# Altium project MCH_CLKB.PrjPcb (part 3 of 3)

## Sheet CLKB_uplinks.SchDoc
size A3
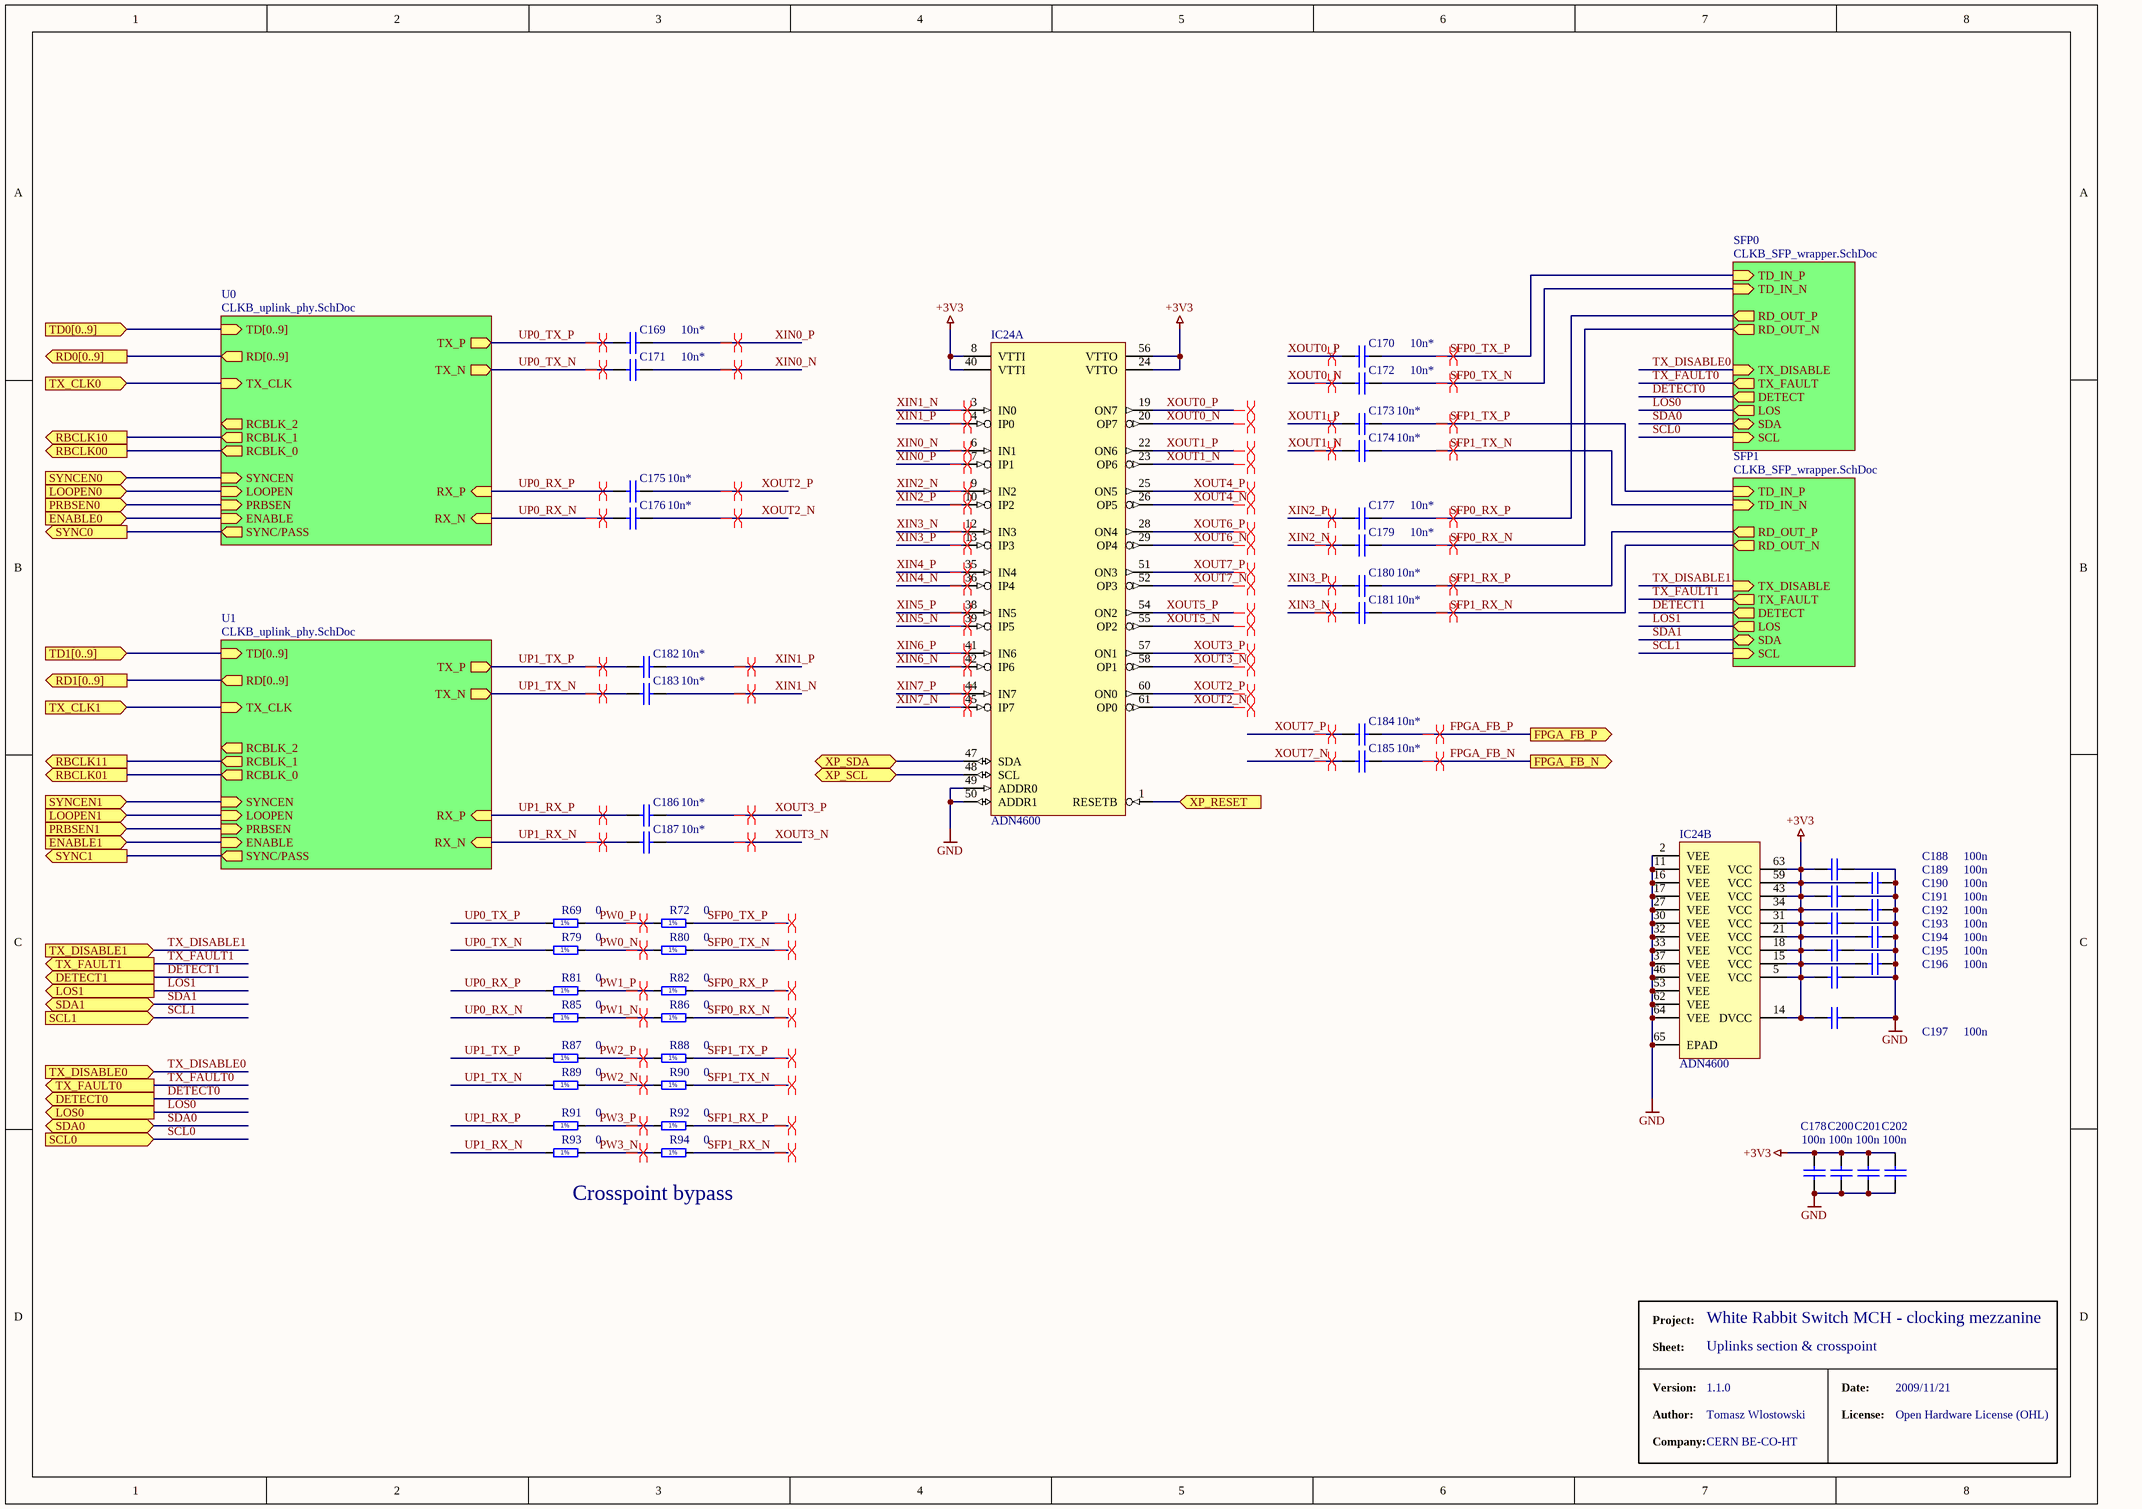
[diagram p4: CLKB_uplinks.SchDoc]

### Parts
C169  10n*  [CAPC1005X55N]
C170  10n*  [CAPC1005X55N]
C171  10n*  [CAPC1005X55N]
C172  10n*  [CAPC1005X55N]
C173  10n*  [CAPC1005X55N]
C174  10n*  [CAPC1005X55N]
C175  10n*  [CAPC1005X55N]
C176  10n*  [CAPC1005X55N]
C177  10n*  [CAPC1005X55N]
C178  100n  [CAPC1005X55N]
C179  10n*  [CAPC1005X55N]
C180  10n*  [CAPC1005X55N]
C181  10n*  [CAPC1005X55N]
C182  10n*  [CAPC1005X55N]
C183  10n*  [CAPC1005X55N]
C184  10n*  [CAPC1005X55N]
C185  10n*  [CAPC1005X55N]
C186  10n*  [CAPC1005X55N]
C187  10n*  [CAPC1005X55N]
C188  100n  [CAPC1005X55N]
C189  100n  [CAPC1005X55N]
C190  100n  [CAPC1005X55N]
C191  100n  [CAPC1005X55N]
C192  100n  [CAPC1005X55N]
C193  100n  [CAPC1005X55N]
C194  100n  [CAPC1005X55N]
C195  100n  [CAPC1005X55N]
C196  100n  [CAPC1005X55N]
C197  100n  [CAPC1005X55N]
C200  100n  [CAPC1005X55N]
C201  100n  [CAPC1005X55N]
C202  100n  [CAPC1005X55N]
IC24  ADN4600  [LFCSP64_ADN4600]  (parts A,B of 2)
R69  0  [RESC1005X40N]
R72  0  [RESC1005X40N]
R79  0  [RESC1005X40N]
R80  0  [RESC1005X40N]
R81  0  [RESC1005X40N]
R82  0  [RESC1005X40N]
R85  0  [RESC1005X40N]
R86  0  [RESC1005X40N]
R87  0  [RESC1005X40N]
R88  0  [RESC1005X40N]
R89  0  [RESC1005X40N]
R90  0  [RESC1005X40N]
R91  0  [RESC1005X40N]
R92  0  [RESC1005X40N]
R93  0  [RESC1005X40N]
R94  0  [RESC1005X40N]

### Sub-sheets
SFP0 = CLKB_SFP_wrapper.SchDoc: TX_FAULT (out), TX_DISABLE (in), SDA (bidir), SCL (in), DETECT (out), LOS (out), RD_OUT_N (out), RD_OUT_P (out), TD_IN_N (in), TD_IN_P (in)
SFP1 = CLKB_SFP_wrapper.SchDoc: TX_FAULT (out), TX_DISABLE (in), SDA (bidir), SCL (in), DETECT (out), LOS (out), RD_OUT_N (out), RD_OUT_P (out), TD_IN_N (in), TD_IN_P (in)
U0 = CLKB_uplink_phy.SchDoc: TD[0..9] (in), SYNCEN (in), LOOPEN (in), PRBSEN (in), ENABLE (in), SYNC/PASS (out), RD[0..9] (out), TX_CLK (in), TX_N (out), TX_P (out), RX_P (in), RX_N (in), RCBLK_0 (out), RCBLK_1 (out), RCBLK_2 (out)
U1 = CLKB_uplink_phy.SchDoc: TD[0..9] (in), SYNCEN (in), LOOPEN (in), PRBSEN (in), ENABLE (in), SYNC/PASS (out), RD[0..9] (out), TX_CLK (in), TX_N (out), TX_P (out), RX_P (in), RX_N (in), RCBLK_0 (out), RCBLK_1 (out), RCBLK_2 (out)

### Ports
DETECT0 (out), DETECT1 (out), ENABLE0 (in), ENABLE1 (in), FPGA_FB_N (out), FPGA_FB_P (out), LOOPEN0 (in), LOOPEN1 (in), LOS0 (out), LOS1 (out), PRBSEN0 (in), PRBSEN1 (in), RBCLK00 (out), RBCLK01 (out), RBCLK10 (out), RBCLK11 (out), RD0[0..9] (out), RD1[0..9] (out), SCL0 (in), SCL1 (in), SDA0 (bidir), SDA1 (bidir), SYNC0 (out), SYNC1 (out), SYNCEN0 (in), SYNCEN1 (in), TD0[0..9] (in), TD1[0..9] (in), TX_CLK0 (in), TX_CLK1 (in), TX_DISABLE0 (in), TX_DISABLE1 (in), TX_FAULT0 (out), TX_FAULT1 (out), XP_RESET (in), XP_SCL (bidir), XP_SDA (bidir)

### Nets
+3V3: C178.2 C188.1 C189.1 C190.1 C191.1 C192.1 C193.1 C194.1 C195.1 C196.1 C197.1 C200.2 C201.2 C202.2 IC24.5(VCC) IC24.8(VTTI) IC24.14(DVCC) IC24.15(VCC) IC24.18(VCC) IC24.21(VCC) IC24.24(VTTO) IC24.31(VCC) IC24.34(VCC) IC24.40(VTTI) IC24.43(VCC) IC24.56(VTTO) IC24.59(VCC) IC24.63(VCC)
GND: C178.1 C188.2 C189.2 C190.2 C191.2 C192.2 C193.2 C194.2 C195.2 C196.2 C197.2 C200.1 C201.1 C202.1 IC24.2(VEE) IC24.11(VEE) IC24.16(VEE) IC24.17(VEE) IC24.27(VEE) IC24.30(VEE) IC24.32(VEE) IC24.33(VEE) IC24.37(VEE) IC24.46(VEE) IC24.49(ADDR0) IC24.50(ADDR1) IC24.53(VEE) IC24.62(VEE) IC24.64(VEE) IC24.65(EPAD)
CY0_U0: port RBCLK00, sheet U0/RCBLK_0
CY0_U1: port RBCLK01, sheet U1/RCBLK_0
CY1_U0: port RBCLK10, sheet U0/RCBLK_1
CY1_U1: port RBCLK11, sheet U1/RCBLK_1
DETECT0: port DETECT0, sheet SFP0/DETECT
DETECT1: port DETECT1, sheet SFP1/DETECT
ENABLE0: port ENABLE0, sheet U0/ENABLE
ENABLE1: port ENABLE1, sheet U1/ENABLE
FPGA_FB_N: C185.2 ; port FPGA_FB_N
FPGA_FB_P: C184.2 ; port FPGA_FB_P
LOOPEN0: port LOOPEN0, sheet U0/LOOPEN
LOOPEN1: port LOOPEN1, sheet U1/LOOPEN
LOS0: port LOS0, sheet SFP0/LOS
LOS1: port LOS1, sheet SFP1/LOS
PRBSEN0: port PRBSEN0, sheet U0/PRBSEN
PRBSEN1: port PRBSEN1, sheet U1/PRBSEN
PW0_N: R79.2 R80.1
PW0_P: R69.2 R72.1
PW1_N: R85.2 R86.1
PW1_P: R81.2 R82.1
PW2_N: R89.2 R90.1
PW2_P: R87.2 R88.1
PW3_N: R93.2 R94.1
PW3_P: R91.2 R92.1
SCL0: port SCL0, sheet SFP0/SCL
SCL1: port SCL1, sheet SFP1/SCL
SDA0: port SDA0, sheet SFP0/SDA
SDA1: port SDA1, sheet SFP1/SDA
SFP0_RX_N: C179.2 R86.2 ; sheet SFP0/RD_OUT_N
SFP0_RX_P: C177.2 R82.2 ; sheet SFP0/RD_OUT_P
SFP0_TX_N: C172.2 R80.2 ; sheet SFP0/TD_IN_N
SFP0_TX_P: C170.2 R72.2 ; sheet SFP0/TD_IN_P
SFP1_RX_N: C181.2 R94.2 ; sheet SFP1/RD_OUT_N
SFP1_RX_P: C180.2 R92.2 ; sheet SFP1/RD_OUT_P
SFP1_TX_N: C174.2 R90.2 ; sheet SFP1/TD_IN_N
SFP1_TX_P: C173.2 R88.2 ; sheet SFP1/TD_IN_P
SYNC0: port SYNC0, sheet U0/SYNC/PASS
SYNC1: port SYNC1, sheet U1/SYNC/PASS
SYNCEN0: port SYNCEN0, sheet U0/SYNCEN
SYNCEN1: port SYNCEN1, sheet U1/SYNCEN
TX_CLK0: port TX_CLK0, sheet U0/TX_CLK
TX_CLK1: port TX_CLK1, sheet U1/TX_CLK
TX_DISABLE0: port TX_DISABLE0, sheet SFP0/TX_DISABLE
TX_DISABLE1: port TX_DISABLE1, sheet SFP1/TX_DISABLE
TX_FAULT0: port TX_FAULT0, sheet SFP0/TX_FAULT
TX_FAULT1: port TX_FAULT1, sheet SFP1/TX_FAULT
UP0_RX_N: C176.1 R85.1 ; sheet U0/RX_N
UP0_RX_P: C175.1 R81.1 ; sheet U0/RX_P
UP0_TX_N: C171.1 R79.1 ; sheet U0/TX_N
UP0_TX_P: C169.1 R69.1 ; sheet U0/TX_P
UP1_RX_N: C187.1 R93.1 ; sheet U1/RX_N
UP1_RX_P: C186.1 R91.1 ; sheet U1/RX_P
UP1_TX_N: C183.1 R89.1 ; sheet U1/TX_N
UP1_TX_P: C182.1 R87.1 ; sheet U1/TX_P
XIN0_N: C171.2 IC24.6(IN1)
XIN0_P: C169.2 IC24.7(IP1)
XIN1_N: C183.2 IC24.3(IN0)
XIN1_P: C182.2 IC24.4(IP0)
XIN2_N: C179.1 IC24.9(IN2)
XIN2_P: C177.1 IC24.10(IP2)
XIN3_N: C181.1 IC24.12(IN3)
XIN3_P: C180.1 IC24.13(IP3)
XIN4_N: IC24.36(IP4)
XIN4_P: IC24.35(IN4)
XIN5_N: IC24.39(IP5)
XIN5_P: IC24.38(IN5)
XIN6_N: IC24.42(IP6)
XIN6_P: IC24.41(IN6)
XIN7_N: IC24.45(IP7)
XIN7_P: IC24.44(IN7)
XOUT0_N: C172.1 IC24.20(OP7)
XOUT0_P: C170.1 IC24.19(ON7)
XOUT1_N: C174.1 IC24.23(OP6)
XOUT1_P: C173.1 IC24.22(ON6)
XOUT2_N: C176.2 IC24.61(OP0)
XOUT2_P: C175.2 IC24.60(ON0)
XOUT3_N: C187.2 IC24.58(OP1)
XOUT3_P: C186.2 IC24.57(ON1)
XOUT4_N: IC24.26(OP5)
XOUT4_P: IC24.25(ON5)
XOUT5_N: IC24.55(OP2)
XOUT5_P: IC24.54(ON2)
XOUT6_N: IC24.29(OP4)
XOUT6_P: IC24.28(ON4)
XOUT7_N: C185.1 IC24.52(OP3)
XOUT7_P: C184.1 IC24.51(ON3)
XP_RESET: IC24.1(RESETB) ; port XP_RESET
XP_SCL: IC24.48(SCL) ; port XP_SCL
XP_SDA: IC24.47(SDA) ; port XP_SDA

### Buses and harness runs
bus port RD0[0..9] = sheet U0/RD[0..9]
bus port RD1[0..9] = sheet U1/RD[0..9]
bus port TD0[0..9] = sheet U0/TD[0..9]
bus port TD1[0..9] = sheet U1/TD[0..9]

### Layout directives
differential pair: FPGA_FB_N, FPGA_FB_P, PW0_N, PW0_P, PW1_N, PW1_P, PW2_N, PW2_P, PW3_N, PW3_P, SFP0_RX_N, SFP0_RX_P, SFP0_TX_N, SFP0_TX_P, SFP1_RX_N, SFP1_RX_P, SFP1_TX_N, SFP1_TX_P, UP0_RX_N, UP0_RX_P, UP0_TX_N, UP0_TX_P, UP1_RX_N, UP1_RX_P, UP1_TX_N, UP1_TX_P, XIN0_N, XIN0_P, XIN1_N, XIN1_P, XIN2_N, XIN2_P, XIN3_N, XIN3_P, XIN4_N, XIN4_P, XIN5_N, XIN5_P, XIN6_N, XIN6_P, XIN7_N, XIN7_P, XOUT0_N, XOUT0_P, XOUT1_N, XOUT1_P, XOUT2_N, XOUT2_P, XOUT3_N, XOUT3_P, XOUT4_N, XOUT4_P, XOUT5_N, XOUT5_P, XOUT6_N, XOUT6_P, XOUT7_N, XOUT7_P

### Notes on the sheet
- Crosspoint bypass
- Project:
- White Rabbit Switch MCH - clocking mezzanine
- Sheet:
- Version:
- Uplinks section & crosspoint
- 1.1.0
- Date:
- 2009/11/21
- Author:
- Company:
- Tomasz Wlostowski
- CERN BE-CO-HT
- License:
- Open Hardware License (OHL)
- (in symbol R0402_0R_JUMPER) 1%

### Library data of the parts
C169-C177 C179-C187 = CC0402_10NF_16V_10%_X7R: Non-polarised capacitor; Part Description: SMD Multilayer Chip Ceramic Capacitor; Manufacturer: GENERIC; Manufacturer1 Part Number: 223878715636; Manufacturer1 Datasheet: \\cern.ch\dfs\Applications\Altium\Datasheets\CC0402_X7R_PHYCOMP.pdf; Value: 10nF; Voltage: 16V; TC: X7R; Tolerance: ±10%; Table: Capacitors SMD; Part Number: CC0402_10NF_16V_10%_X7R; Component Kind: Standard; Component Type: Standard; Designator: Capacitor - non polarized; Library Reference: Capacitor - non polarized; Pin Count: 2; Status: Not Recommended; Manufacturer Part Number: CC0402_10NF_16V_10%_X7R; Case: 0402; Mounted: Yes; Socket: No; SMD: Yes; Manufacturer1 Example: PHYCOMP; Manufacturer1 ComponentHeight: 0.55mm; HelpURL: \\cern.ch\dfs\Applications\Altium\Datasheets\CC0402_X7R_PHYCOMP.pdf; Author: CERN DEM JLC; CreateDate: 2007-12-03; LatestRevisionDate: 2007-12-03
C178 C188-C197 C200-C202 = CC0402_100NF_16V_10%_X7R: as C41 on sheet CLKB_clocking_system; Part Number: CC0402_100NF_16V_10%_X7R; Component Kind: Standard; Component Type: Standard; Designator: Capacitor - non polarized; Library Reference: Capacitor - non polarized; Pin Count: 2; Status: Not Recommended; Manufacturer Part Number: CC0402_100NF_16V_10%_X7R; Case: 0402; Mounted: Yes; Socket: No; SMD: Yes; Manufacturer1 Example: PHYCOMP; Manufacturer1 ComponentHeight: 0.55mm; HelpURL: \\cern.ch\dfs\Applications\Altium\Datasheets\CC0402_X7R_PHYCOMP.pdf; Author: CERN DEM JLC; CreateDate: 2007-12-03; LatestRevisionDate: 2007-12-03
IC24 = ADN4600: Gigabit 8x8 crosspoint switch
R69 R72 R79-R82 R85-R94 = R0402_0R_JUMPER: Resistor - 1%; Part Description: 1A (0.05R Max DC Resistance) Zero Ohm Jumper; Manufacturer: GENERIC; Manufacturer1 Part Number: 232270591001; Manufacturer1 Datasheet: \\cern.ch\dfs\Applications\Altium\Datasheets\R0402_Phycomp_RC0402.pdf; Table: Resistors SMD; Part Number: R0402_0R_JUMPER; Component Kind: Standard; Component Type: Standard; Designator: Resistor - 1%; Library Reference: Resistor - 1%; Pin Count: 2; Value: 0; Status: Not recommended; Manufacturer Part Number: R0402_0R_JUMPER; Case: 0402; Mounted: Yes; Socket: No; SMD: Yes; Manufacturer1 Example: PHYCOMP; Manufacturer1 ComponentHeight: 0.4mm; HelpURL: \\cern.ch\dfs\Applications\Altium\Datasheets\R0402_Phycomp_RC0402.pdf; Author: CERN DEM JLC; CreateDate: 2007-12-03; LatestRevisionDate: 2008-03-13

## Sheet CLKB_uplink_phy.SchDoc
size A3
Used 2 times, as channels U0, U1. Parts and nets are listed once, with the designators drawn on the sheet.
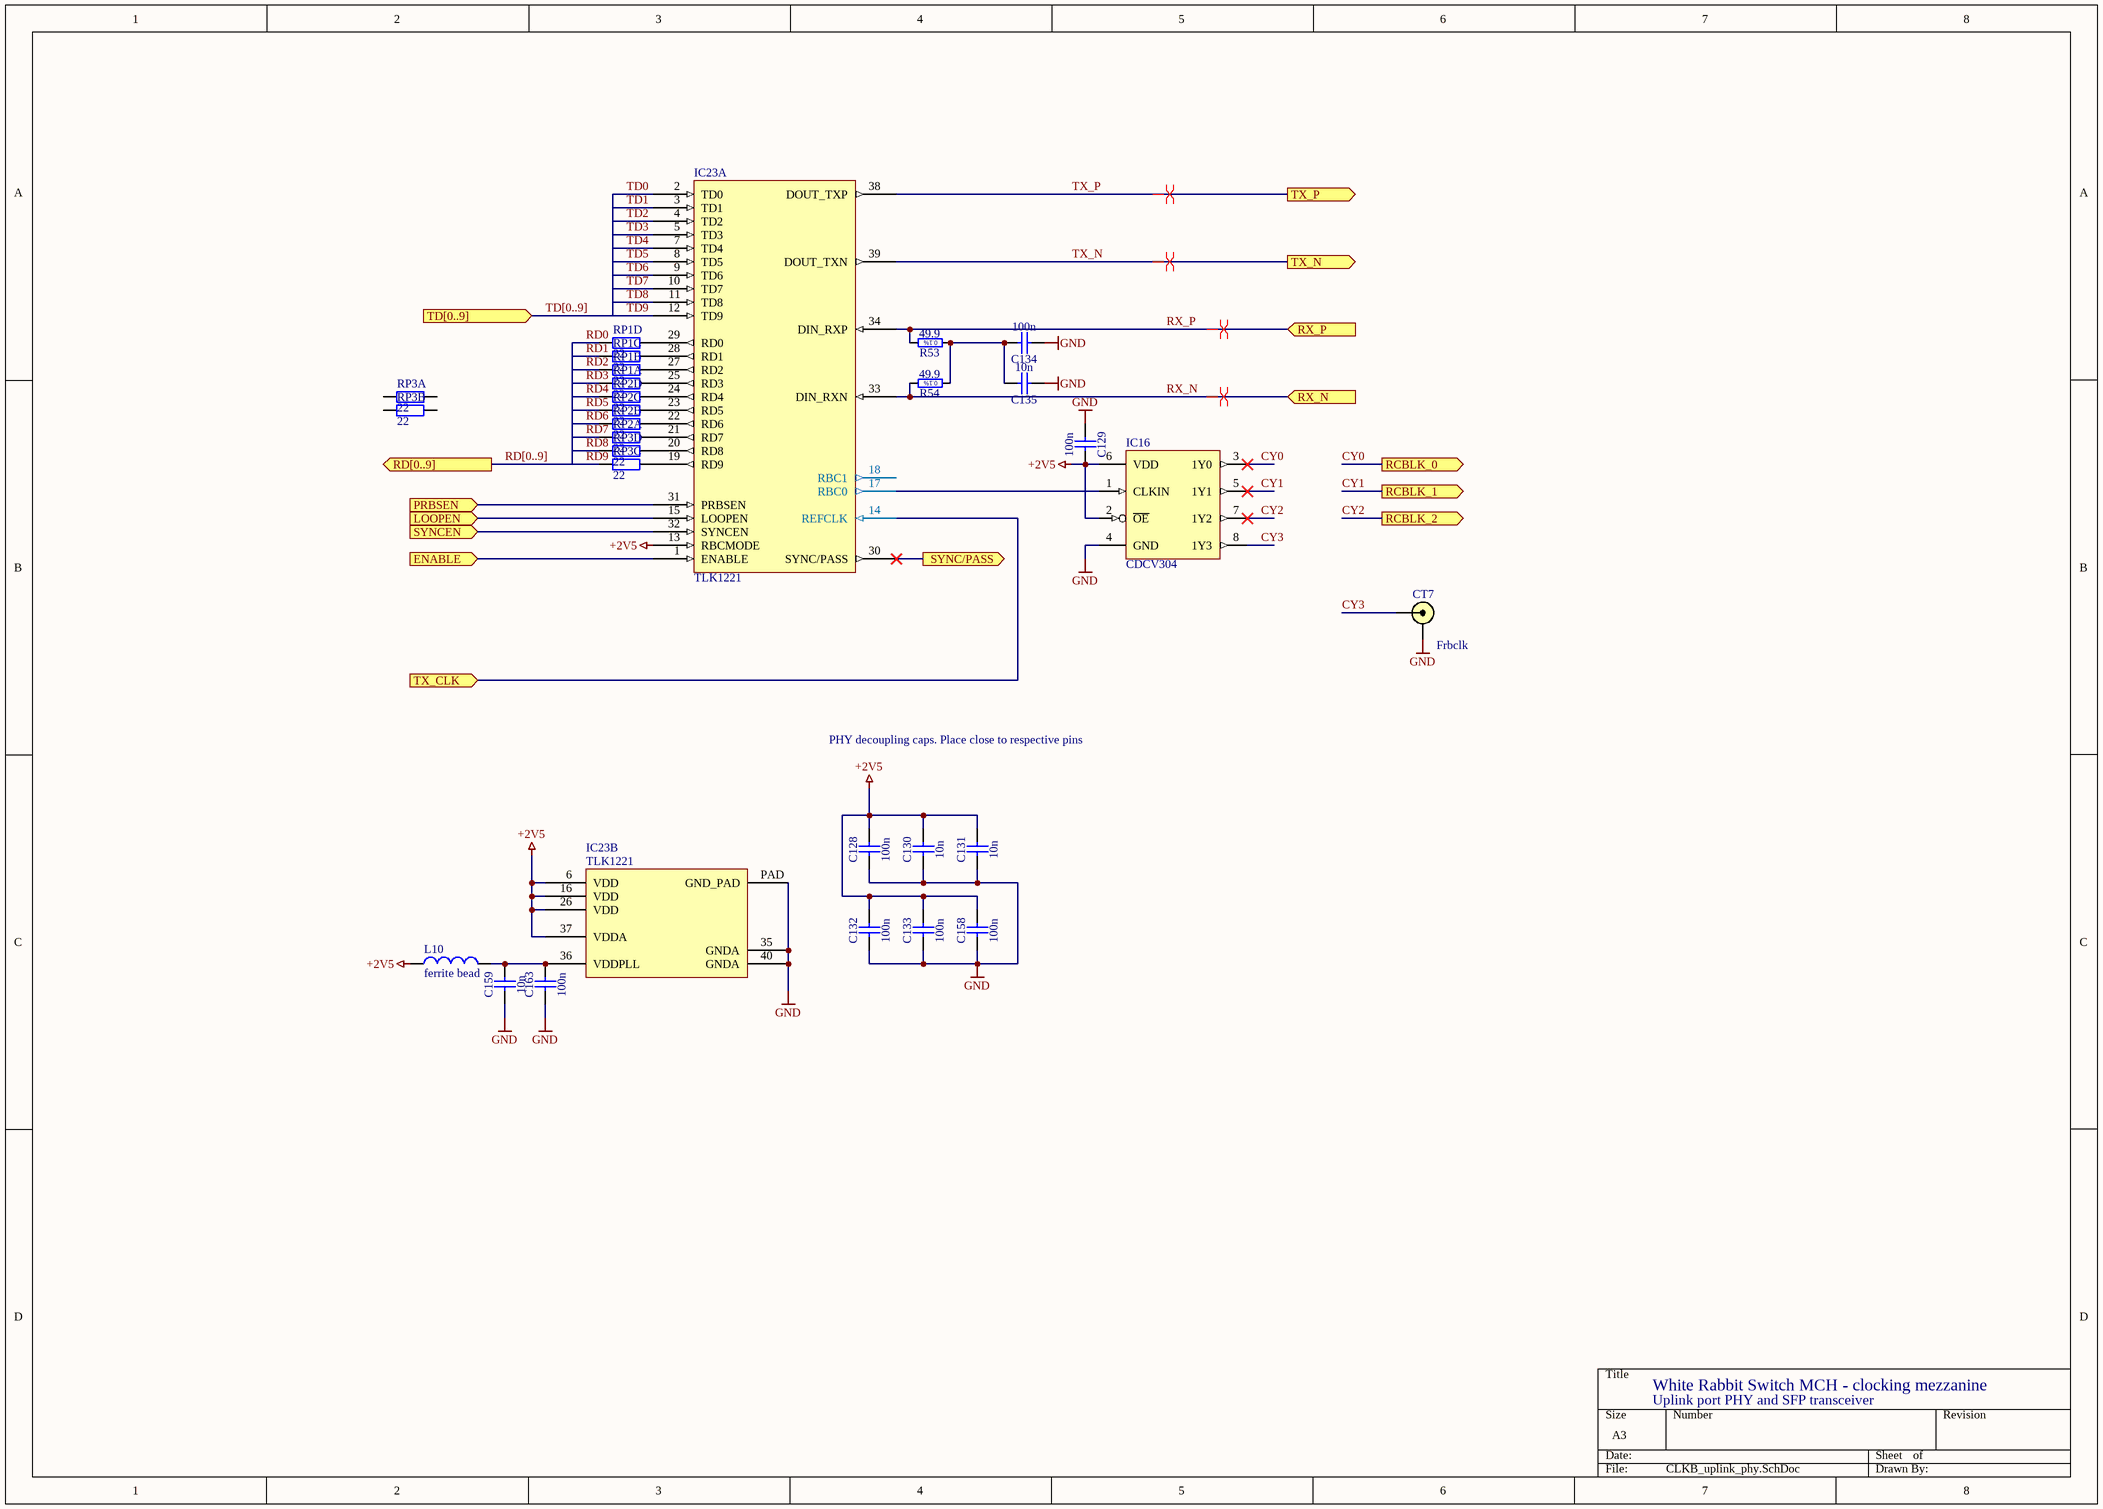
[diagram p5: CLKB_uplink_phy.SchDoc]

### Parts
C128  100n  [CAPC1005X55N]
C129  100n  [CAPC1608X87N]
C130  10n  [CAPC1005X55N]
C131  10n  [CAPC1005X55N]
C132  100n  [CAPC1005X55N]
C133  100n  [CAPC1005X55N]
C134  100n  [CAPC1608X87N]
C135  10n  [CAPC1608X87N]
C158  100n  [CAPC1005X55N]
C159  10n  [CAPC1005X55N]
C163  100n  [CAPC1005X55N]
CT7  Frbclk  [CON_UFL_HIROSE_RECEPTACLE]
IC16  CDCV304  [TSOP65P490-8AN]
IC23  TLK1221  [QFN40_powerpad]  (parts A,B of 2)
L10  value ferrite bead  [INDC1608-0603]  (hidden comment: Inductor)
R53  49.9  [RESC1608X55N]
R54  49.9  [RESC1608X55N]
RP1  value 22  [YC124]  (hidden comment: 22 0804)  (parts A,B,C,D of 4)
RP2  value 22  [YC124]  (hidden comment: 22 0804)  (parts A,B,C,D of 4)
RP3  value 22  [YC124]  (hidden comment: 22 0804)  (parts A,B,C,D of 4)

### Ports
ENABLE (in), LOOPEN (in), PRBSEN (in), RCBLK_0 (out), RCBLK_1 (out), RCBLK_2 (out), RD[0..9] (out), RX_N (in), RX_P (in), SYNC/PASS (out), SYNCEN (in), TD[0..9] (in), TX_CLK (in), TX_N (out), TX_P (out)

### Nets
+2V5: C128.2 C129.2 C130.2 C131.2 C132.2 C133.2 C158.2 IC16.2(~{OE}) IC16.6(VDD) IC23.6(VDD) IC23.13(RBCMODE) IC23.16(VDD) IC23.26(VDD) IC23.37(VDDA) L10.2
GND: C128.1 C129.1 C130.1 C131.1 C132.1 C133.1 C134.1 C135.1 C158.1 C159.1 C163.1 CT7.2 IC16.4(GND) IC23.35(GNDA) IC23.40(GNDA) IC23.PAD(GND_PAD)
CY0: IC16.3(1Y0) ; port RCBLK_0
CY1: IC16.5(1Y1) ; port RCBLK_1
CY2: IC16.7(1Y2) ; port RCBLK_2
CY3: CT7.1 IC16.8(1Y3)
ENABLE: IC23.1(ENABLE) ; port ENABLE
LOOPEN: IC23.15(LOOPEN) ; port LOOPEN
PRBSEN: IC23.31(PRBSEN) ; port PRBSEN
RD0: RP1.4(A)
RD1: RP1.3(A)
RD2: RP1.2(A)
RD3: RP1.1(A)
RD4: RP2.4(A)
RD5: RP2.3(A)
RD6: RP2.2(A)
RD7: RP2.1(A)
RD8: RP3.4(A)
RD9: RP3.3(A)
RX_N: IC23.33(DIN_RXN) R54.2 ; port RX_N
RX_P: IC23.34(DIN_RXP) R53.2 ; port RX_P
SYNC/PASS: IC23.30(SYNC/PASS) ; port SYNC/PASS
SYNCEN: IC23.32(SYNCEN) ; port SYNCEN
TD0: IC23.2(TD0)
TD1: IC23.3(TD1)
TD2: IC23.4(TD2)
TD3: IC23.5(TD3)
TD4: IC23.7(TD4)
TD5: IC23.8(TD5)
TD6: IC23.9(TD6)
TD7: IC23.10(TD7)
TD8: IC23.11(TD8)
TD9: IC23.12(TD9)
TX_CLK: IC23.14(REFCLK) ; port TX_CLK
TX_N: IC23.39(DOUT_TXN) ; port TX_N
TX_P: IC23.38(DOUT_TXP) ; port TX_P
NetC134_2: C134.2 C135.2 R53.1 R54.1
NetC159_2: C159.2 C163.2 IC23.36(VDDPLL) L10.1
NetIC16_1: IC16.1(CLKIN) IC23.17(RBC0)
NetIC23_19: IC23.19(RD9) RP3.6(B)
NetIC23_20: IC23.20(RD8) RP3.5(B)
NetIC23_21: IC23.21(RD7) RP2.8(B)
NetIC23_22: IC23.22(RD6) RP2.7(B)
NetIC23_23: IC23.23(RD5) RP2.6(B)
NetIC23_24: IC23.24(RD4) RP2.5(B)
NetIC23_25: IC23.25(RD3) RP1.8(B)
NetIC23_27: IC23.27(RD2) RP1.7(B)
NetIC23_28: IC23.28(RD1) RP1.6(B)
NetIC23_29: IC23.29(RD0) RP1.5(B)

Not connected (* = marked no-connect by the designer): IC23 18(RBC1); RP3 1(A) 2(A) 7(B) 8(B)

### Channels
U0: designators end in _U0; ports ENABLE=ENABLE0 LOOPEN=LOOPEN0 PRBSEN=PRBSEN0 RCBLK_0=CY0_U0 RCBLK_1=CY1_U0 RCBLK_2=CY2_U0 RX_N=UP0_RX_N RX_P=UP0_RX_P SYNC/PASS=SYNC0 SYNCEN=SYNCEN0 TX_CLK=TX_CLK0 TX_N=UP0_TX_N TX_P=UP0_TX_P
U1: designators end in _U1; ports ENABLE=ENABLE1 LOOPEN=LOOPEN1 PRBSEN=PRBSEN1 RCBLK_0=CY0_U1 RCBLK_1=CY1_U1 RCBLK_2=CY2_U1 RX_N=UP1_RX_N RX_P=UP1_RX_P SYNC/PASS=SYNC1 SYNCEN=SYNCEN1 TX_CLK=TX_CLK1 TX_N=UP1_TX_N TX_P=UP1_TX_P

### Buses and harness runs
bus RD[0..9] = port RD[0..9]
bus TD[0..9] = port TD[0..9]

### Layout directives
differential pair: UP0_RX_N, UP0_RX_P, UP0_TX_N, UP0_TX_P

### Notes on the sheet
- PHY decoupling caps. Place close to respective pins
- White Rabbit Switch MCH - clocking mezzanine
- Uplink port PHY and SFP transceiver
- (in symbol R0603_49R9_0.1%_0.063W_10PPM) 0.1%

### Library data of the parts
C128 C132 C133 C158 C163 = CC0402_100NF_16V_10%_X7R: Non-polarised capacitor; Part Description: SMD Multilayer Chip Ceramic Capacitor; Manufacturer: GENERIC; Manufacturer1 Part Number: 223878715649; Manufacturer1 Datasheet: \\cern.ch\dfs\Applications\Altium\Datasheets\CC0402_X7R_PHYCOMP.pdf; Value: 100nF; Voltage: 16V; TC: X7R; Tolerance: ±10%; Table: Capacitors SMD; Part Number: CC0402_100NF_16V_10%_X7R; Component Kind: Standard; Component Type: Standard; Designator: Capacitor - non polarized; Library Reference: Capacitor - non polarized; Pin Count: 2; Status: Not Recommended; Manufacturer Part Number: CC0402_100NF_16V_10%_X7R; Case: 0402; Mounted: Yes; Socket: No; SMD: Yes; Manufacturer1 Example: PHYCOMP; Manufacturer1 ComponentHeight: 0.55mm; HelpURL: \\cern.ch\dfs\Applications\Altium\Datasheets\CC0402_X7R_PHYCOMP.pdf; Author: CERN DEM JLC; CreateDate: 2007-12-03; LatestRevisionDate: 2007-12-03
C129 C134 = CC0603_100NF_50V_10%_X7R: Non-polarised capacitor; Part Description: SMD Multilayer Chip Ceramic Capacitor; Manufacturer: GENERIC; Manufacturer1 Part Number: 223858615649; Manufacturer1 Datasheet: \\cern.ch\dfs\Applications\Altium\Datasheets\CC0603_X7R_PHYCOMP.pdf; Value: 100nF; Voltage: 50V; TC: X7R; Tolerance: ±10%; Table: Capacitors SMD; Part Number: CC0603_100NF_50V_10%_X7R; Component Kind: Standard; Component Type: Standard; Designator: Capacitor - non polarized; Library Reference: Capacitor - non polarized; Pin Count: 2; Status: Preferred; Manufacturer Part Number: CC0603_100NF_50V_10%_X7R; Case: 0603; Mounted: Yes; Socket: No; SMD: Yes; Manufacturer1 Example: PHYCOMP; Manufacturer1 ComponentHeight: 0.87mm; HelpURL: \\cern.ch\dfs\Applications\Altium\Datasheets\CC0603_X7R_PHYCOMP.pdf; Author: CERN DEM JLC; CreateDate: 12/3/2007; LatestRevisionDate: 12/3/2007
C130 C131 C159 = CC0402_10NF_16V_10%_X7R: Non-polarised capacitor; Part Description: SMD Multilayer Chip Ceramic Capacitor; Manufacturer: GENERIC; Manufacturer1 Part Number: 223878715636; Manufacturer1 Datasheet: \\cern.ch\dfs\Applications\Altium\Datasheets\CC0402_X7R_PHYCOMP.pdf; Value: 10nF; Voltage: 16V; TC: X7R; Tolerance: ±10%; Table: Capacitors SMD; Part Number: CC0402_10NF_16V_10%_X7R; Component Kind: Standard; Component Type: Standard; Designator: Capacitor - non polarized; Library Reference: Capacitor - non polarized; Pin Count: 2; Status: Not Recommended; Manufacturer Part Number: CC0402_10NF_16V_10%_X7R; Case: 0402; Mounted: Yes; Socket: No; SMD: Yes; Manufacturer1 Example: PHYCOMP; Manufacturer1 ComponentHeight: 0.55mm; HelpURL: \\cern.ch\dfs\Applications\Altium\Datasheets\CC0402_X7R_PHYCOMP.pdf; Author: CERN DEM JLC; CreateDate: 2007-12-03; LatestRevisionDate: 2007-12-03
C135 = CC0603_10NF_50V_10%_X7R: Non-polarised capacitor; Part Description: SMD Multilayer Chip Ceramic Capacitor; Manufacturer: GENERIC; Manufacturer1 Part Number: 223858615636; Manufacturer1 Datasheet: \\cern.ch\dfs\Applications\Altium\Datasheets\CC0603_X7R_PHYCOMP.pdf; Value: 10nF; Voltage: 50V; TC: X7R; Tolerance: ±10%; Table: Capacitors SMD; Part Number: CC0603_10NF_50V_10%_X7R; Component Kind: Standard; Component Type: Standard; Designator: Capacitor - non polarized; Library Reference: Capacitor - non polarized; Pin Count: 2; Status: Preferred; Manufacturer Part Number: CC0603_10NF_50V_10%_X7R; Case: 0603; Mounted: Yes; Socket: No; SMD: Yes; Manufacturer1 Example: PHYCOMP; Manufacturer1 ComponentHeight: 0.87mm; HelpURL: \\cern.ch\dfs\Applications\Altium\Datasheets\CC0603_X7R_PHYCOMP.pdf; Author: CERN DEM JLC; CreateDate: 12/3/2007; LatestRevisionDate: 12/3/2007
CT7 = CON_TESTPOINT_UFL: UFL connector testpoint
IC16 = CDCV304: 1:4 LVTTL fanout
IC23 = TLK1221: Texas Instruments Gigabit Ethernet PHY with deterministic clocking and LVPECL output interface; RefId: 1576976; Value: TLK1221RHAT; Supplier: Farnell
L10 = Inductor: Ferrite bead; Published: 8-Jun-2000; Revision: July-2002: Re-released for DXP Platform.; Publisher: Altium Limited
R53 R54 = R0603_49R9_0.1%_0.063W_10PPM: Resistor - 0.1%; Part Description: Thin Film Chip Resistor; Manufacturer: GENERIC; Manufacturer1 Part Number: RN73C1J49R9BTDF; Manufacturer1 Datasheet: \\cern.ch\dfs\Applications\Altium\Datasheets\R0603_Tyco_RN73.pdf; Value: 49R9; Power: 0.063W; TC: ±10ppm; Table: Resistors SMD; Part Number: R0603_49R9_0.1%_0.063W_10PPM; Component Kind: Standard; Component Type: Standard; Designator: Resistor - 0.1%; Library Reference: Resistor - 0.1%; Pin Count: 2; Status: Not recommended; Tolerance: ±0.1%; Manufacturer Part Number: R0603_49R9_0.1%_0.063W_10PPM; Case: 0603; Mounted: Yes; Socket: No; SMD: Yes; Manufacturer1 Example: TYCO HOLSWORTHY; Manufacturer1 ComponentHeight: 0.5mm; HelpURL: \\cern.ch\dfs\Applications\Altium\Datasheets\R0603_Tyco_RN73.pdf; Author: CERN DEM JLC; CreateDate: 12/3/2007; LatestRevisionDate: 3/13/2008
RP1-RP3 = Res_Pack4_22R_YC124: 4-resistor pack; RefId: AVX  CRB2A4 series; Supplier: Farnell

## Sheet CLKB_SFP_wrapper.SchDoc
size A4
Used 2 times, as channels SFP0, SFP1. Parts and nets are listed once, with the designators drawn on the sheet.
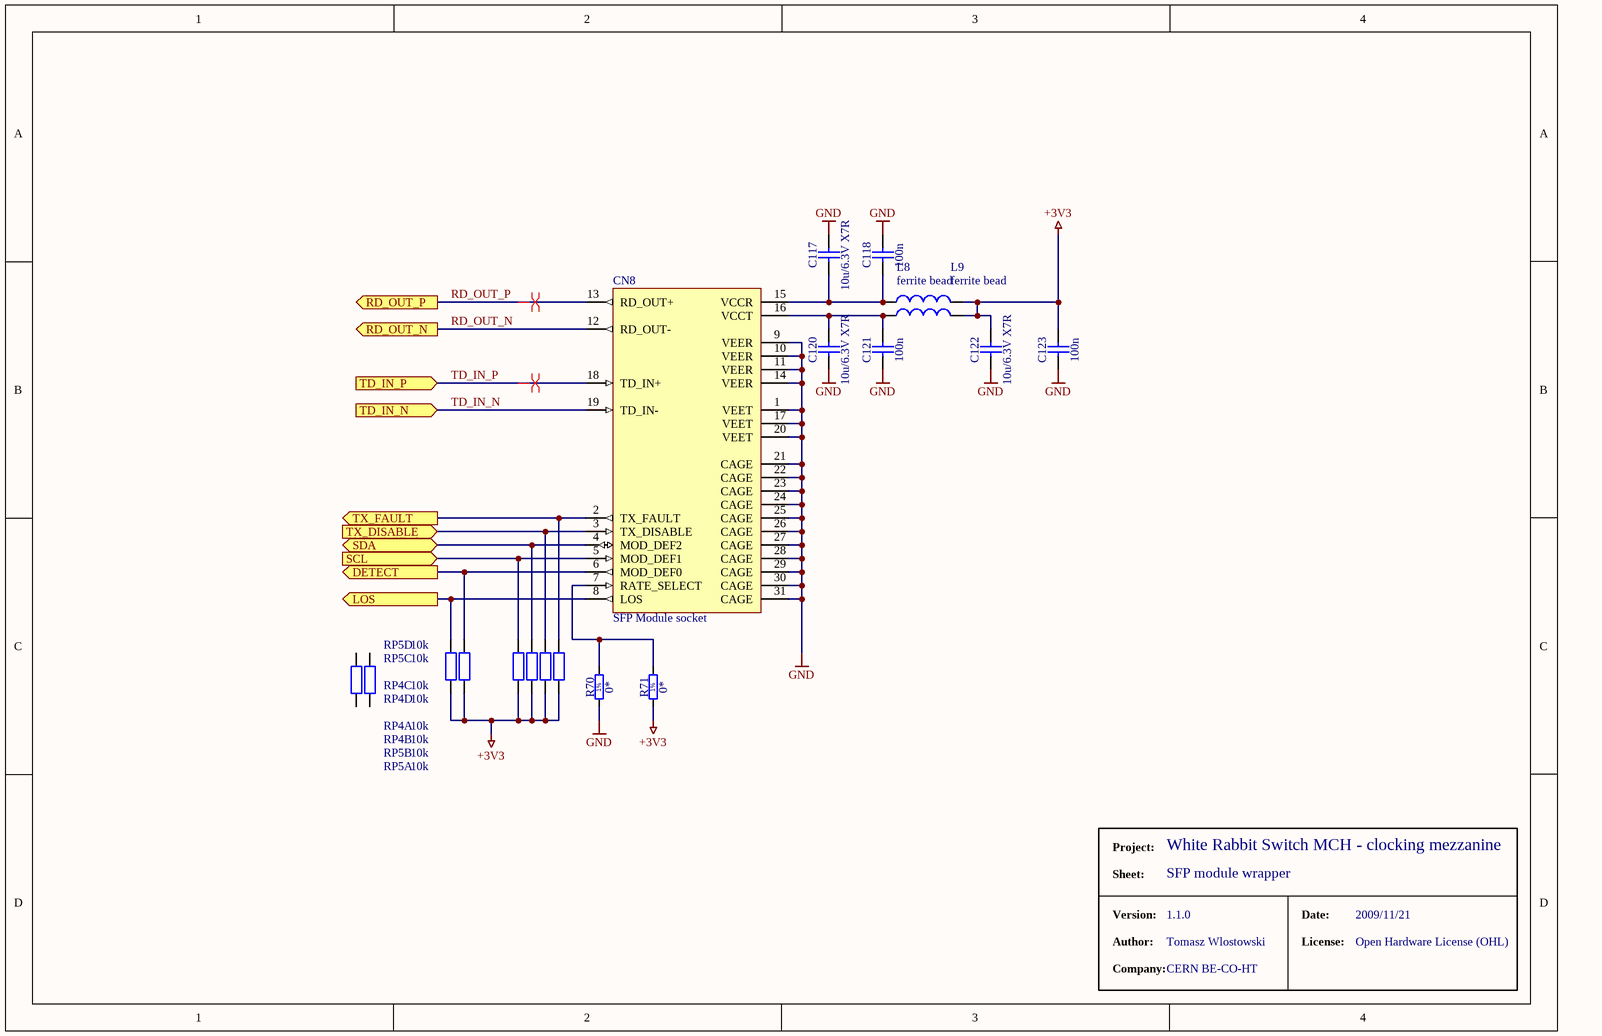
[diagram p6: CLKB_SFP_wrapper.SchDoc]

### Parts
C117  10u/6.3V X7R  [CAPC3216X140N]
C118  100n  [CAPC1608X87N]
C120  10u/6.3V X7R  [CAPC3216X140N]
C121  100n  [CAPC1608X87N]
C122  10u/6.3V X7R  [CAPC3216X140N]
C123  100n  [CAPC1608X87N]
CN8  SFP Module socket  [SFP_SINGLE_PORT]
L8  value ferrite bead  [INDC2012-0805]  (hidden comment: Inductor)
L9  value ferrite bead  [INDC2012-0805]  (hidden comment: Inductor)
R70  0*  [RESC1608X55N]
R71  0*  [RESC1608X55N]
RP4  value 10k  [YC124]  (hidden comment: 10k 0804)  (parts A,B,C,D of 4)
RP5  value 10k  [YC124]  (hidden comment: 10k 0804)  (parts A,B,C,D of 4)

### Ports
DETECT (out), LOS (out), RD_OUT_N (out), RD_OUT_P (out), SCL (in), SDA (bidir), TD_IN_N (in), TD_IN_P (in), TX_DISABLE (in), TX_FAULT (out)

### Nets
+3V3: C122.2 C123.2 L8.2 L9.2 R71.1 RP4.1(A) RP4.2(A) RP4.3(A) RP4.4(A) RP5.1(A) RP5.2(A)
GND: C117.2 C118.2 C120.1 C121.1 C122.1 C123.1 CN8.1(VEET) CN8.9(VEER) CN8.10(VEER) CN8.11(VEER) CN8.14(VEER) CN8.17(VEET) CN8.20(VEET) CN8.21(CAGE) CN8.22(CAGE) CN8.23(CAGE) CN8.24(CAGE) CN8.25(CAGE) CN8.26(CAGE) CN8.27(CAGE) CN8.28(CAGE) CN8.29(CAGE) CN8.30(CAGE) CN8.31(CAGE) R70.1
DETECT: CN8.6(MOD_DEF0) RP4.6(B) ; port DETECT
LOS: CN8.8(LOS) RP4.5(B) ; port LOS
RD_OUT_N: CN8.12(RD_OUT-) ; port RD_OUT_N
RD_OUT_P: CN8.13(RD_OUT+) ; port RD_OUT_P
SCL: CN8.5(MOD_DEF1) RP4.7(B) ; port SCL
SDA: CN8.4(MOD_DEF2) RP4.8(B) ; port SDA
TD_IN_N: CN8.19(TD_IN-) ; port TD_IN_N
TD_IN_P: CN8.18(TD_IN+) ; port TD_IN_P
TX_DISABLE: CN8.3(TX_DISABLE) RP5.7(B) ; port TX_DISABLE
TX_FAULT: CN8.2(TX_FAULT) RP5.8(B) ; port TX_FAULT
NetC117_1: C117.1 C118.1 CN8.15(VCCR) L9.1
NetC120_2: C120.2 C121.2 CN8.16(VCCT) L8.1
NetCN8_7: CN8.7(RATE_SELECT) R70.2 R71.2

Not connected (* = marked no-connect by the designer): RP5 3(A) 4(A) 5(B) 6(B)

### Channels
SFP0: designators end in _SFP0; ports DETECT=DETECT0 LOS=LOS0 RD_OUT_N=SFP0_RX_N RD_OUT_P=SFP0_RX_P SCL=SCL0 SDA=SDA0 TD_IN_N=SFP0_TX_N TD_IN_P=SFP0_TX_P TX_DISABLE=TX_DISABLE0 TX_FAULT=TX_FAULT0
SFP1: designators end in _SFP1; ports DETECT=DETECT1 LOS=LOS1 RD_OUT_N=SFP1_RX_N RD_OUT_P=SFP1_RX_P SCL=SCL1 SDA=SDA1 TD_IN_N=SFP1_TX_N TD_IN_P=SFP1_TX_P TX_DISABLE=TX_DISABLE1 TX_FAULT=TX_FAULT1

### Layout directives
differential pair: SFP0_RX_P, SFP0_TX_P

### Notes on the sheet
- Project:
- White Rabbit Switch MCH - clocking mezzanine
- Sheet:
- Version:
- SFP module wrapper
- 1.1.0
- Date:
- 2009/11/21
- Author:
- Company:
- Tomasz Wlostowski
- CERN BE-CO-HT
- License:
- Open Hardware License (OHL)
- (in symbol R0603_0R_JUMPER) 1%

### Library data of the parts
C117 C120 C122 = CC1206_10UF_10V_10%_X7R: Non-polarised capacitor; Part Description: SMD Multilayer Chip Ceramic Capacitor; Manufacturer: GENERIC; Manufacturer1 Part Number: C1206C106K8RAC; Manufacturer1 Datasheet: \\cern.ch\dfs\Applications\Altium\Datasheets\CC1206_X7R_KEMET.pdf; Value: 10uF; Voltage: 10V; Tolerance: ±10%; Table: Capacitors SMD; Part Number: CC1206_10UF_10V_10%_X7R; Component Kind: Standard; Component Type: Standard; Designator: Capacitor - non polarized; Library Reference: Capacitor - non polarized; Pin Count: 2; Status: Preferred; TC: X7R; Manufacturer Part Number: CC1206_10uF_10V_10%_X7R; Case: 1206; Mounted: Yes; Socket: No; SMD: Yes; Manufacturer1 Example: KEMET; Manufacturer1 ComponentHeight: 1.8mm; HelpURL: \\cern.ch\dfs\Applications\Altium\Datasheets\CC1206_X7R_KEMET.pdf; Author: CERN DEM JLC; CreateDate: 12/3/2007; LatestRevisionDate: 12/3/2007
C118 C121 C123 = CC0603_100NF_50V_10%_X7R: as C129 on sheet CLKB_uplink_phy; Part Number: CC0603_100NF_50V_10%_X7R; Component Kind: Standard; Component Type: Standard; Designator: Capacitor - non polarized; Library Reference: Capacitor - non polarized; Pin Count: 2; Status: Preferred; Manufacturer Part Number: CC0603_100NF_50V_10%_X7R; Case: 0603; Mounted: Yes; Socket: No; SMD: Yes; Manufacturer1 Example: PHYCOMP; Manufacturer1 ComponentHeight: 0.87mm; HelpURL: \\cern.ch\dfs\Applications\Altium\Datasheets\CC0603_X7R_PHYCOMP.pdf; Author: CERN DEM JLC; CreateDate: 12/3/2007; LatestRevisionDate: 12/3/2007
CN8 = SFP_SOCKET_SINGLE: Socket for SFP module; RefId: Far/1256176
L8 L9 = Inductor: Ferrite bead; Published: 8-Jun-2000; Revision: July-2002: Re-released for DXP Platform.; Publisher: Altium Limited
R70 R71 = R0603_0R_JUMPER: Resistor - 1%; Part Description: 1A (0.05R Max DC Resistance) Zero Ohm Jumper; Manufacturer: GENERIC; Manufacturer1 Part Number: NRC06Z0; Manufacturer1 Datasheet: \\cern.ch\dfs\Applications\Altium\Datasheets\R0603_NIC_NRC.pdf; Value: 0; Table: Resistors SMD; Part Number: R0603_0R_JUMPER; Component Kind: Standard; Component Type: Standard; Designator: Resistor - 1%; Library Reference: Resistor - 1%; Pin Count: 2; Status: Preferred; Manufacturer Part Number: R0603_0R_JUMPER; Case: 0603; Mounted: Yes; Socket: No; SMD: Yes; Manufacturer1 Example: NIC COMPONENT; Manufacturer1 ComponentHeight: 0.55mm; HelpURL: \\cern.ch\dfs\Applications\Altium\Datasheets\R0603_NIC_NRC.pdf; Author: CERN DEM JLC; CreateDate: 12/3/2007; LatestRevisionDate: 3/13/2008
RP4 RP5 = Res_Pack4_10k_YC124: 4-resistor pack; RefId: AVX  CRB2A4 series; Supplier: Farnell

## Sheet CLKB_fabric_interface.SchDoc
size A3
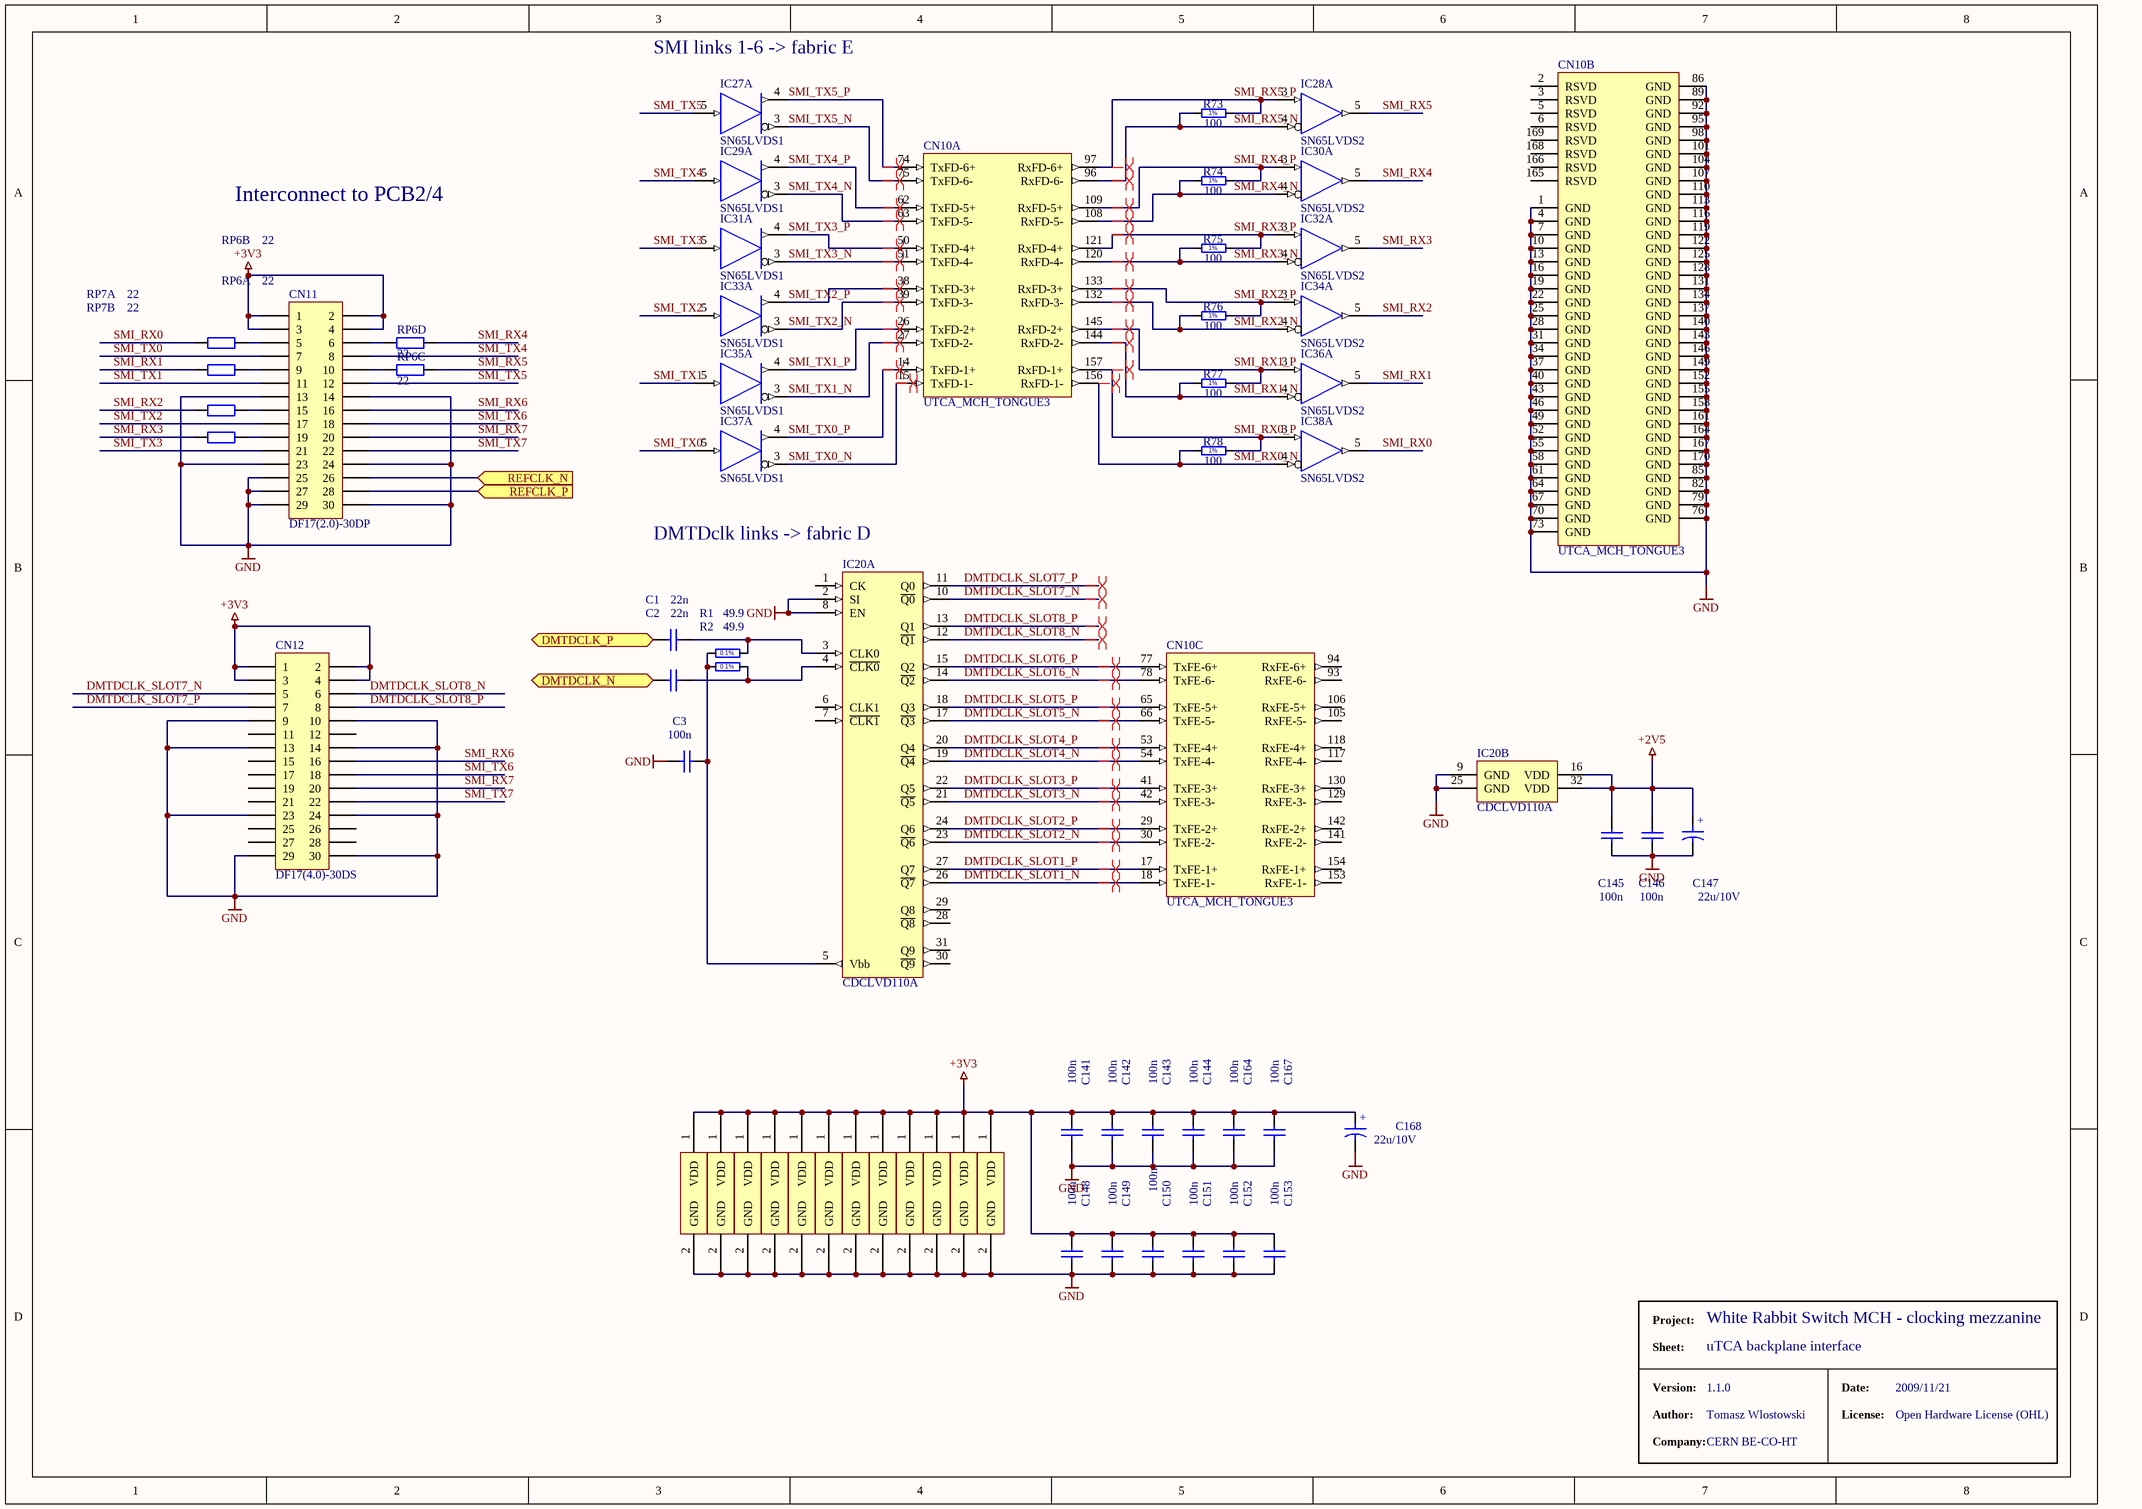
[diagram p7: CLKB_fabric_interface.SchDoc]

### Parts
C1  22n  [CAPC1005X55N]
C2  22n  [CAPC1005X55N]
C3  100n  [CAPC1608X87N]
C141  100n  [CAPC1608X87N]
C142  100n  [CAPC1608X87N]
C143  100n  [CAPC1608X87N]
C144  100n  [CAPC1608X87N]
C145  100n  [CAPC1608X87N]
C146  100n  [CAPC1608X87N]
C147  22u/10V  [CAPMP3216X180N]
C148  100n  [CAPC1608X87N]
C149  100n  [CAPC1608X87N]
C150  100n  [CAPC1608X87N]
C151  100n  [CAPC1608X87N]
C152  100n  [CAPC1608X87N]
C153  100n  [CAPC1608X87N]
C164  100n  [CAPC1608X87N]
C167  100n  [CAPC1608X87N]
C168  22u/10V  [CAPMP3216X180N]
CN10  UTCA_MCH_TONGUE3  [UTCA_MCH_TONGUE2_3_4]  (parts A,B,C of 7)
CN11  DF17(2.0)-30DP  [DF17-30-PLUG]
CN12  DF17(4.0)-30DS  [DF17-30-SOCKET]
IC20  CDCLVD110A  [QFP80P900X900-32M]  (parts A,B of 2)
IC27  SN65LVDS1  [SOT23-5AL]  (parts A,B of 2)
IC28  SN65LVDS2  [SOT23-5AL]  (parts A,B of 2)
IC29  SN65LVDS1  [SOT23-5AL]  (parts A,B of 2)
IC30  SN65LVDS2  [SOT23-5AL]  (parts A,B of 2)
IC31  SN65LVDS1  [SOT23-5AL]  (parts A,B of 2)
IC32  SN65LVDS2  [SOT23-5AL]  (parts A,B of 2)
IC33  SN65LVDS1  [SOT23-5AL]  (parts A,B of 2)
IC34  SN65LVDS2  [SOT23-5AL]  (parts A,B of 2)
IC35  SN65LVDS1  [SOT23-5AL]  (parts A,B of 2)
IC36  SN65LVDS2  [SOT23-5AL]  (parts A,B of 2)
IC37  SN65LVDS1  [SOT23-5AL]  (parts A,B of 2)
IC38  SN65LVDS2  [SOT23-5AL]  (parts A,B of 2)
R1  49.9  [RESC1608X55N]
R2  49.9  [RESC1608X55N]
R73  100  [RESC1608X55N]
R74  100  [RESC1608X55N]
R75  100  [RESC1608X55N]
R76  100  [RESC1608X55N]
R77  100  [RESC1608X55N]
R78  100  [RESC1608X55N]
RP6  value 22  [YC124]  (hidden comment: 22 0804)  (parts A,B,C,D of 4)
RP7  value 22  [YC124]  (hidden comment: 22 0804)  (parts A,B of 4)

### Ports
DMTDCLK_N (in), DMTDCLK_P (in), REFCLK_N (in), REFCLK_P (in)

### Nets
+2V5: C145.1 C146.1 C147.1 IC20.16(VDD) IC20.32(VDD)
+3V3: C141.1 C142.1 C143.1 C144.1 C148.1 C149.1 C150.1 C151.1 C152.1 C153.1 C164.1 C167.1 C168.1 CN11.1 CN11.2 CN11.3 CN11.4 CN12.1 CN12.2 CN12.3 CN12.4 IC27.1(VDD) IC28.1(VDD) IC29.1(VDD) IC30.1(VDD) IC31.1(VDD) IC32.1(VDD) IC33.1(VDD) IC34.1(VDD) IC35.1(VDD) IC36.1(VDD) IC37.1(VDD) IC38.1(VDD)
GND: C3.1 C141.2 C142.2 C143.2 C144.2 C145.2 C146.2 C147.2 C148.2 C149.2 C150.2 C151.2 C152.2 C153.2 C164.2 C167.2 C168.2 CN10.1(GND) CN10.4(GND) CN10.7(GND) CN10.10(GND) CN10.13(GND) CN10.16(GND) CN10.19(GND) CN10.22(GND) CN10.25(GND) CN10.28(GND) CN10.31(GND) CN10.34(GND) CN10.37(GND) CN10.40(GND) CN10.43(GND) CN10.46(GND) CN10.49(GND) CN10.52(GND) CN10.55(GND) CN10.58(GND) CN10.61(GND) CN10.64(GND) CN10.67(GND) CN10.70(GND) CN10.73(GND) CN10.76(GND) CN10.79(GND) CN10.82(GND) CN10.85(GND) CN10.86(GND) CN10.89(GND) CN10.92(GND) CN10.95(GND) CN10.98(GND) CN10.101(GND) CN10.104(GND) CN10.107(GND) CN10.110(GND) CN10.113(GND) CN10.116(GND) CN10.119(GND) CN10.122(GND) CN10.125(GND) CN10.128(GND) CN10.131(GND) CN10.134(GND) CN10.137(GND) CN10.140(GND) CN10.143(GND) CN10.146(GND) CN10.149(GND) CN10.152(GND) CN10.155(GND) CN10.158(GND) CN10.161(GND) CN10.164(GND) CN10.167(GND) CN10.170(GND) CN11.13 CN11.14 CN11.23 CN11.24 CN11.25 CN11.27 CN11.29 CN11.30 CN12.9 CN12.10 CN12.13 CN12.14 CN12.23 CN12.24 CN12.29 CN12.30 IC20.2(SI) IC20.8(EN) IC20.9(GND) IC20.25(GND) IC27.2(GND) IC28.2(GND) IC29.2(GND) IC30.2(GND) IC31.2(GND) IC32.2(GND) IC33.2(GND) IC34.2(GND) IC35.2(GND) IC36.2(GND) IC37.2(GND) IC38.2(GND)
DMTDCLK_N: C2.1 ; port DMTDCLK_N
DMTDCLK_P: C1.1 ; port DMTDCLK_P
DMTDCLK_SLOT1_N: CN10.18(TxFE-1-) IC20.26(~{Q7})
DMTDCLK_SLOT1_P: CN10.17(TxFE-1+) IC20.27(Q7)
DMTDCLK_SLOT2_N: CN10.30(TxFE-2-) IC20.23(~{Q6})
DMTDCLK_SLOT2_P: CN10.29(TxFE-2+) IC20.24(Q6)
DMTDCLK_SLOT3_N: CN10.42(TxFE-3-) IC20.21(~{Q5})
DMTDCLK_SLOT3_P: CN10.41(TxFE-3+) IC20.22(Q5)
DMTDCLK_SLOT4_N: CN10.54(TxFE-4-) IC20.19(~{Q4})
DMTDCLK_SLOT4_P: CN10.53(TxFE-4+) IC20.20(Q4)
DMTDCLK_SLOT5_N: CN10.66(TxFE-5-) IC20.17(~{Q3})
DMTDCLK_SLOT5_P: CN10.65(TxFE-5+) IC20.18(Q3)
DMTDCLK_SLOT6_N: CN10.78(TxFE-6-) IC20.14(~{Q2})
DMTDCLK_SLOT6_P: CN10.77(TxFE-6+) IC20.15(Q2)
DMTDCLK_SLOT7_N: CN12.5 IC20.10(~{Q0})
DMTDCLK_SLOT7_P: CN12.7 IC20.11(Q0)
DMTDCLK_SLOT8_N: CN12.6 IC20.12(~{Q1})
DMTDCLK_SLOT8_P: CN12.8 IC20.13(Q1)
REFCLK_N: CN11.26 ; port REFCLK_N
REFCLK_P: CN11.28 ; port REFCLK_P
SMI_RX0: IC38.5(Q) RP6.2(A)
SMI_RX0_N: CN10.156(RxFD-1-) IC38.4(/A) R78.1
SMI_RX0_P: CN10.157(RxFD-1+) IC38.3(A) R78.2
SMI_RX1: IC36.5(Q) RP6.1(A)
SMI_RX1_N: CN10.144(RxFD-2-) IC36.4(/A) R77.1
SMI_RX1_P: CN10.145(RxFD-2+) IC36.3(A) R77.2
SMI_RX2: IC34.5(Q) RP7.2(A)
SMI_RX2_N: CN10.132(RxFD-3-) IC34.4(/A) R76.1
SMI_RX2_P: CN10.133(RxFD-3+) IC34.3(A) R76.2
SMI_RX3: IC32.5(Q) RP7.1(A)
SMI_RX3_N: CN10.120(RxFD-4-) IC32.4(/A) R75.1
SMI_RX3_P: CN10.121(RxFD-4+) IC32.3(A) R75.2
SMI_RX4: IC30.5(Q) RP6.4(A)
SMI_RX4_N: CN10.108(RxFD-5-) IC30.4(/A) R74.1
SMI_RX4_P: CN10.109(RxFD-5+) IC30.3(A) R74.2
SMI_RX5: IC28.5(Q) RP6.3(A)
SMI_RX5_N: CN10.96(RxFD-6-) IC28.4(/A) R73.1
SMI_RX5_P: CN10.97(RxFD-6+) IC28.3(A) R73.2
SMI_RX6: CN11.16 CN12.16
SMI_RX7: CN11.20 CN12.20
SMI_TX0: CN11.7 IC37.5(A)
SMI_TX0_N: CN10.15(TxFD-1-) IC37.3(/Q)
SMI_TX0_P: CN10.14(TxFD-1+) IC37.4(Q)
SMI_TX1: CN11.11 IC35.5(A)
SMI_TX1_N: CN10.27(TxFD-2-) IC35.3(/Q)
SMI_TX1_P: CN10.26(TxFD-2+) IC35.4(Q)
SMI_TX2: CN11.17 IC33.5(A)
SMI_TX2_N: CN10.39(TxFD-3-) IC33.3(/Q)
SMI_TX2_P: CN10.38(TxFD-3+) IC33.4(Q)
SMI_TX3: CN11.21 IC31.5(A)
SMI_TX3_N: CN10.51(TxFD-4-) IC31.3(/Q)
SMI_TX3_P: CN10.50(TxFD-4+) IC31.4(Q)
SMI_TX4: CN11.8 IC29.5(A)
SMI_TX4_N: CN10.63(TxFD-5-) IC29.3(/Q)
SMI_TX4_P: CN10.62(TxFD-5+) IC29.4(Q)
SMI_TX5: CN11.12 IC27.5(A)
SMI_TX5_N: CN10.75(TxFD-6-) IC27.3(/Q)
SMI_TX5_P: CN10.74(TxFD-6+) IC27.4(Q)
SMI_TX6: CN11.18 CN12.18
SMI_TX7: CN11.22 CN12.22
NetC1_2: C1.2 IC20.3(CLK0) R1.2
NetC2_2: C2.2 IC20.4(~{CLK0}) R2.2
NetC3_2: C3.2 IC20.5(CLK0) R1.1 R2.1
NetCN11_5: CN11.5 RP6.7(B)
NetCN11_6: CN11.6 RP6.5(B)
NetCN11_9: CN11.9 RP6.8(B)
NetCN11_10: CN11.10 RP6.6(B)
NetCN11_15: CN11.15 RP7.7(B)
NetCN11_19: CN11.19 RP7.8(B)

Not connected (* = marked no-connect by the designer): CN10 2(RSVD) 3(RSVD) 5(RSVD) 6(RSVD) 93(RxFE-6-) 94(RxFE-6+) 105(RxFE-5-) 106(RxFE-5+) 117(RxFE-4-) 118(RxFE-4+) 129(RxFE-3-) 130(RxFE-3+) 141(RxFE-2-) 142(RxFE-2+) 153(RxFE-1-) 154(RxFE-1+) 165(RSVD) 166(RSVD) 168(RSVD) 169(RSVD); CN12 11 12 15 17 19 21 25 26 27 28; IC20 1(CK) 6(CLK1) 7(~{CLK1}) 28(~{Q8}) 29(Q8) 30(~{Q9}) 31(Q9)

### Layout directives
differential pair: DMTDCLK_SLOT1_N, DMTDCLK_SLOT1_P, DMTDCLK_SLOT2_N, DMTDCLK_SLOT2_P, DMTDCLK_SLOT3_N, DMTDCLK_SLOT3_P, DMTDCLK_SLOT4_N, DMTDCLK_SLOT4_P, DMTDCLK_SLOT5_N, DMTDCLK_SLOT5_P, DMTDCLK_SLOT6_N, DMTDCLK_SLOT6_P, DMTDCLK_SLOT7_N, DMTDCLK_SLOT7_P, DMTDCLK_SLOT8_N, DMTDCLK_SLOT8_P, SMI_RX0_N, SMI_RX0_P, SMI_RX1_N, SMI_RX1_P, SMI_RX2_N, SMI_RX2_P, SMI_RX3_N, SMI_RX3_P, SMI_RX4_N, SMI_RX4_P, SMI_RX5_N, SMI_RX5_P, SMI_TX0_N, SMI_TX0_P, SMI_TX1_N, SMI_TX1_P, SMI_TX2_N, SMI_TX2_P, SMI_TX3_N, SMI_TX3_P, SMI_TX4_N, SMI_TX4_P, SMI_TX5_N, SMI_TX5_P

### Notes on the sheet
- (near IC27) SMI links 1-6 -> fabric E
- Interconnect to PCB2/4
- DMTDclk links -> fabric D
- Project:
- White Rabbit Switch MCH - clocking mezzanine
- Sheet:
- Version:
- uTCA backplane interface
- 1.1.0
- Date:
- 2009/11/21
- Author:
- Company:
- Tomasz Wlostowski
- CERN BE-CO-HT
- License:
- Open Hardware License (OHL)
- (in symbol CTE3216-18_22UF_10V_10%) +
- (in symbol R0603_49R9_0.1%_0.063W_10PPM) 0.1%
- (in symbol R0603_100R_1%_0.1W_100PPM) 1%

### Library data of the parts
C1 C2 = CC0402_22NF_16V_10%_X7R: Non-polarised capacitor; Part Description: SMD Multilayer Chip Ceramic Capacitor; Manufacturer: GENERIC; Manufacturer1 Part Number: 223878715641; Manufacturer1 Datasheet: \\cern.ch\dfs\Applications\Altium\Datasheets\CC0402_X7R_PHYCOMP.pdf; Value: 22nF; Voltage: 16V; TC: X7R; Tolerance: ±10%; Table: Capacitors SMD; Part Number: CC0402_22NF_16V_10%_X7R; Component Kind: Standard; Component Type: Standard; Designator: Capacitor - non polarized; Library Reference: Capacitor - non polarized; Pin Count: 2; Status: Not Recommended; Manufacturer Part Number: CC0402_22NF_16V_10%_X7R; Case: 0402; Mounted: Yes; Socket: No; SMD: Yes; Manufacturer1 Example: PHYCOMP; Manufacturer1 ComponentHeight: 0.55mm; HelpURL: \\cern.ch\dfs\Applications\Altium\Datasheets\CC0402_X7R_PHYCOMP.pdf; Author: CERN DEM JLC; CreateDate: 2007-12-03; LatestRevisionDate: 2007-12-03
C3 C141-C146 C148-C153 C164 C167 = CC0603_100NF_50V_10%_X7R: as C129 on sheet CLKB_uplink_phy; Part Number: CC0603_100NF_50V_10%_X7R; Component Kind: Standard; Component Type: Standard; Designator: Capacitor - non polarized; Library Reference: Capacitor - non polarized; Pin Count: 2; Status: Preferred; Manufacturer Part Number: CC0603_100NF_50V_10%_X7R; Case: 0603; Mounted: Yes; Socket: No; SMD: Yes; Manufacturer1 Example: PHYCOMP; Manufacturer1 ComponentHeight: 0.87mm; HelpURL: \\cern.ch\dfs\Applications\Altium\Datasheets\CC0603_X7R_PHYCOMP.pdf; Author: CERN DEM JLC
  C3: CreateDate: 2007-12-03; LatestRevisionDate: 2007-12-03
  C141-C146 C148-C153 C164 C167: CreateDate: 12/3/2007; LatestRevisionDate: 12/3/2007
C147 C168 = CTE3216-18_22UF_10V_10%: Polarised capacitor; Part Description: Solid Tantalum Chip Capacitor; Manufacturer: GENERIC; Manufacturer1 Part Number: TAJA226K010R; Manufacturer1 Datasheet: \\cern.ch\dfs\Applications\Altium\Datasheets\CTE_AVX_TAJ.pdf; Value: 22uF; Voltage: 10V; Tolerance: ±10%; Table: Capacitors SMD; Part Number: CTE3216-18_22UF_10V_10%; Component Kind: Standard; Component Type: Standard; Designator: Capacitor - polarized; Library Reference: Capacitor - polarized; Pin Count: 2; Status: Preferred; Manufacturer Part Number: CTE3216-18_22UF_10V_10%; Case: A; Mounted: Yes; Socket: No; SMD: Yes; Manufacturer1 Example: AVX; Manufacturer1 ComponentHeight: 1.8mm; HelpURL: \\cern.ch\dfs\Applications\Altium\Datasheets\CTE_AVX_TAJ.pdf; Author: CERN DEM JLC; CreateDate: 12/3/2007; LatestRevisionDate: 12/3/2007
CN10 = UTCA_MCH_TONGUE3: microTCA MTCA.0 standard MCH connector 3
CN11 = KX14_30p: multipin B2B connector (plug); Supplier: Mouser
CN12 = KX15_30p: multipin B2B connector (plug); Supplier: Mouser
IC20 = CDCLVD110A: TI LVDS 1:10 fanout
IC27 IC29 IC31 IC33 IC35 IC37 = SN65LVDS1: TTL->LVDS buffer; RefId: 8452482; Value: SN65LVDS1DBVT; Supplier: Farnell
IC28 IC30 IC32 IC34 IC36 IC38 = SN65LVDS2: LVDS->TTL buffer; RefId: 1652269; Value: SN65LVDS2DBVR; Supplier: Farnell
R1 R2 = R0603_49R9_0.1%_0.063W_10PPM: as R53 on sheet CLKB_uplink_phy; Part Number: R0603_49R9_0.1%_0.063W_10PPM; Component Kind: Standard; Component Type: Standard; Designator: Resistor - 0.1%; Library Reference: Resistor - 0.1%; Pin Count: 2; Status: Not recommended; Tolerance: ±0.1%; Manufacturer Part Number: R0603_49R9_0.1%_0.063W_10PPM; Case: 0603; Mounted: Yes; Socket: No; SMD: Yes; Manufacturer1 Example: TYCO HOLSWORTHY; Manufacturer1 ComponentHeight: 0.5mm; HelpURL: \\cern.ch\dfs\Applications\Altium\Datasheets\R0603_Tyco_RN73.pdf; Author: CERN DEM JLC; CreateDate: 2007-12-03; LatestRevisionDate: 2008-03-13
R73-R78 = R0603_100R_1%_0.1W_100PPM: Resistor - 1%; Part Description: General Purpose Thick Film Chip Resistor; Manufacturer: GENERIC; Manufacturer1 Part Number: NRC06F4700TRF; Manufacturer1 Datasheet: \\cern.ch\dfs\Applications\Altium\Datasheets\R0603_NIC_NRC.pdf; Power: 0.1W; TC: ±100ppm/°C; Table: Resistors SMD; Part Number: R0603_100R_1%_0.1W_100PPM; Component Kind: Standard; Component Type: Standard; Designator: Resistor - 1%; Library Reference: Resistor - 1%; Pin Count: 2; Value: 100; Status: Preferred; Tolerance: ±1%; Manufacturer Part Number: R0603_100R_1%_0.1W_100PPM; Case: 0603; Mounted: Yes; Socket: No; SMD: Yes; Manufacturer1 Example: NIC COMPONENT; Manufacturer1 ComponentHeight: 0.55mm; HelpURL: \\cern.ch\dfs\Applications\Altium\Datasheets\R0603_NIC_NRC.pdf; Author: CERN DEM JLC; CreateDate: 12/3/2007; LatestRevisionDate: 3/13/2008
RP6 RP7 = Res_Pack4_22R_YC124: as RP1 on sheet CLKB_uplink_phy; Supplier: Farnell

## Nets that join several sheets
+1V2: CLKB_clocking_fpga (20 pins), CLKB_power_regulators (5 pins)
+2V5: CLKB_clocking_fpga (23 pins), CLKB_power_regulators (C198.1), U0 (15 pins), U1 (15 pins), CLKB_fabric_interface (5 pins)
+3V3: CLKB_clocking_fpga (12 pins), CLKB_clocking_system (26 pins), CLKB_power_regulators (C111.1 C199.1 D5.1 IC22.3), CLKB_temp_sensors (11 pins), CLKB_uplinks (28 pins), SFP0 (11 pins), SFP1 (11 pins), CLKB_fabric_interface (33 pins)
+3V3_OSC: CLKB_clocking_system (40 pins), CLKB_power_regulators (C106.2 C107.2 C109.1 IC21.4)
+5V: CLKB_clocking_system (IC17.2), CLKB_power_regulators (7 pins)
GND: CLKB_clocking_fpga (52 pins), CLKB_clocking_system (103 pins), CLKB_power_regulators (21 pins), CLKB_temp_sensors (11 pins), CLKB_uplinks (30 pins), U0 (16 pins), U1 (16 pins), SFP0 (25 pins), SFP1 (25 pins), CLKB_fabric_interface (107 pins)
SFP0_RX_N: CLKB_uplinks (C179.2 R86.2), SFP0 (CN8_SFP0.12)
SFP0_RX_P: CLKB_uplinks (C177.2 R82.2), SFP0 (CN8_SFP0.13)
SFP0_TX_N: CLKB_uplinks (C172.2 R80.2), SFP0 (CN8_SFP0.19)
SFP0_TX_P: CLKB_uplinks (C170.2 R72.2), SFP0 (CN8_SFP0.18)
SFP1_RX_N: CLKB_uplinks (C181.2 R94.2), SFP1 (CN8_SFP1.12)
SFP1_RX_P: CLKB_uplinks (C180.2 R92.2), SFP1 (CN8_SFP1.13)
SFP1_TX_N: CLKB_uplinks (C174.2 R90.2), SFP1 (CN8_SFP1.19)
SFP1_TX_P: CLKB_uplinks (C173.2 R88.2), SFP1 (CN8_SFP1.18)
UP0_RX_N: CLKB_uplinks (C176.1 R85.1), U0 (IC23_U0.33 R54_U0.2)
UP0_RX_P: CLKB_uplinks (C175.1 R81.1), U0 (IC23_U0.34 R53_U0.2)
UP0_TX_N: CLKB_uplinks (C171.1 R79.1), U0 (IC23_U0.39)
UP0_TX_P: CLKB_uplinks (C169.1 R69.1), U0 (IC23_U0.38)
UP1_RX_N: CLKB_uplinks (C187.1 R93.1), U1 (IC23_U1.33 R54_U1.2)
UP1_RX_P: CLKB_uplinks (C186.1 R91.1), U1 (IC23_U1.34 R53_U1.2)
UP1_TX_N: CLKB_uplinks (C183.1 R89.1), U1 (IC23_U1.39)
UP1_TX_P: CLKB_uplinks (C182.1 R87.1), U1 (IC23_U1.38)